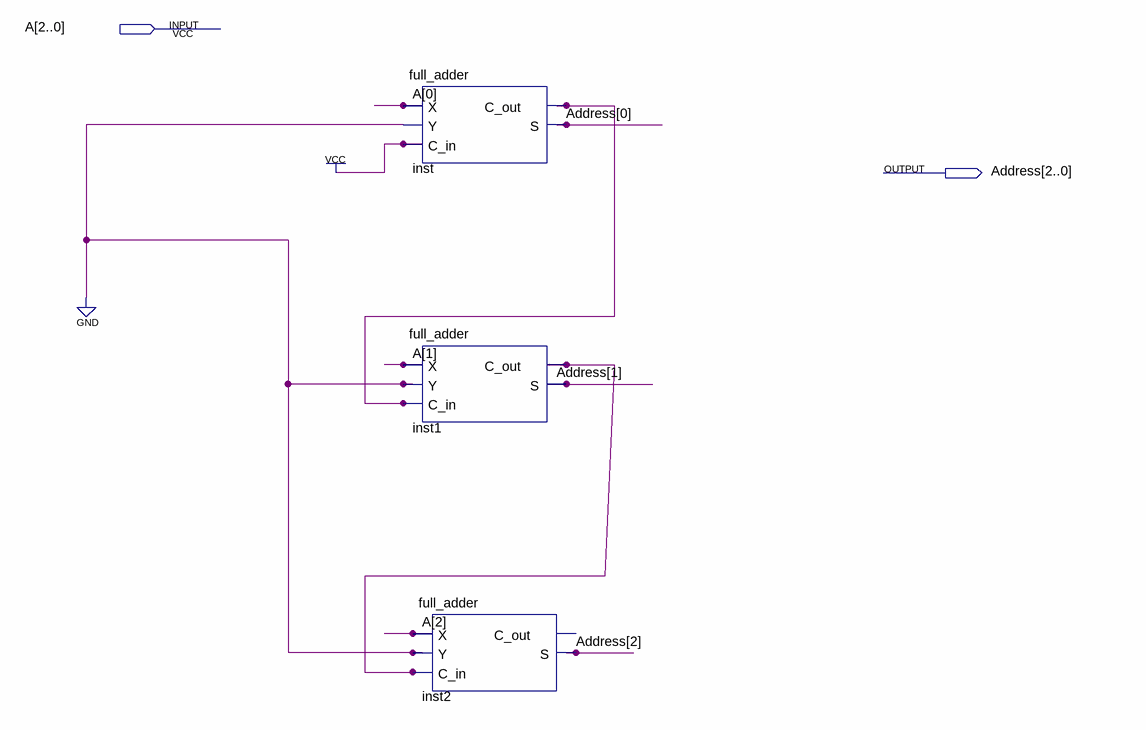
[diagram p0: schematic sheet]
// Quartus schematic address_handler.bdf as structural Verilog: 3 symbols, 2 pins
module address_handler (
  input  [2:0] A,
  output [2:0] Address
);

  wire inst1_c_out, inst_c_out;

  full_adder inst (.X(A[0]), .Y(1'b0), .C_in(1'b1), .C_out(inst_c_out), .S(Address[0]));
  full_adder inst1 (.X(A[1]), .Y(1'b0), .C_in(inst_c_out), .C_out(inst1_c_out), .S(Address[1]));
  full_adder inst2 (.X(A[2]), .Y(1'b0), .C_in(inst1_c_out), .S(Address[2]));  // open: C_out
endmodule
